# Altium schematic sheet Knock Sensing.SchDoc: Ravage - Knock Sensing
size A4; Address1: Drawn By:; Address2: Dan Visser; DocumentNumber: A; Revision: 0.1-alpha; SheetNumber: 9; SheetTotal: 16
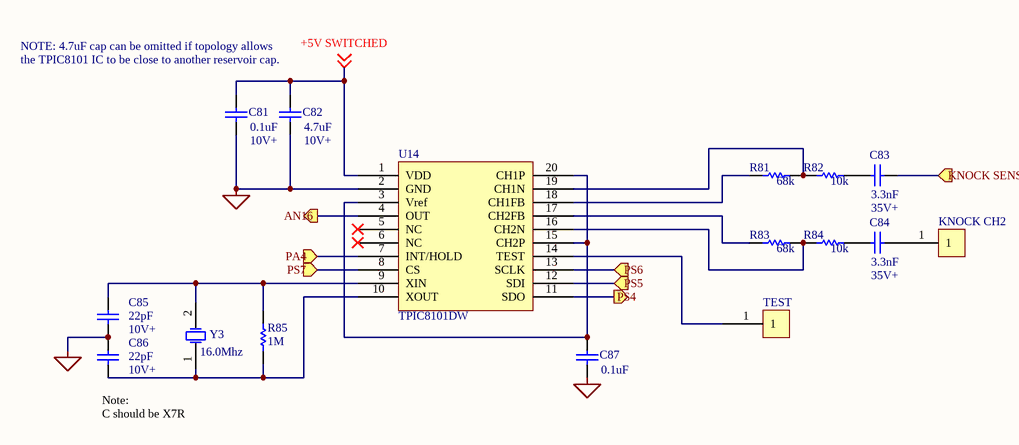
[diagram p0: Knock Sensing.SchDoc]

## Parts
C81  value 0.1uF  [RAD-0.3]
C82  value 4.7uF  [RAD-0.3]
C83  value 3.3nF  [RAD-0.3]
C84  value 3.3nF  [RAD-0.3]
C85  value 22pF  [RAD-0.3]
C86  value 22pF  [RAD-0.3]
C87  value 0.1uF  [RAD-0.3]
KNOCK_CH2  (no value)
R81  value 68k  [AXIAL-0.3]
R82  value 10k  [AXIAL-0.3]
R83  value 68k  [AXIAL-0.3]
R84  value 10k  [AXIAL-0.3]
R85  value 1M  [AXIAL-0.3]
TEST  (no value)
U14  TPIC8101DW  [SOIC20_N]
Y3  16.0Mhz  [R38]

## Ports
AN16 (out), KNOCK SENSOR (in), PA4 (in), PS4 (out), PS5 (in), PS6 (in), PS7 (in)

## Nets
NetC81_1: C81.1 C82.1 C85.1 C86.2 C87.1 U14.2(GND)
+5V SWITCHED: C81.2 C82.2 U14.1(VDD) ; off-sheet +5V SWITCHED
AN16: U14.4(OUT) ; port AN16
KNOCK SENSOR: C83.2 ; port KNOCK SENSOR
PA4: U14.7(INT/HOLD) ; port PA4
PS4: U14.11(SDO) ; port PS4
PS5: U14.12(SDI) ; port PS5
PS6: U14.13(SCLK) ; port PS6
PS7: U14.8(CS) ; port PS7
NetC83_1: C83.1 R82.2
NetC84_1: C84.1 R84.2
NetC84_2: C84.2 KNOCK_CH2.1
NetC85_2: C85.2 R85.1 U14.9(XIN) Y3.2(OSC2)
NetC86_1: C86.1 R85.2 U14.10(XOUT) Y3.1(OSC1)
NetC87_2: C87.2 U14.3(Vref) U14.15(CH2P) U14.20(CH1P)
NetR81_1: R81.1 U14.18(CH1FB)
NetR81_2: R81.2 R82.1 U14.19(CH1N)
NetR83_1: R83.1 U14.17(CH2FB)
NetR83_2: R83.2 R84.1 U14.16(CH2N)
NetTEST_1: TEST.1 U14.14(TEST)

Not connected (* = marked no-connect by the designer): U14 5(NC)* 6(NC)*

## Notes on the sheet
- NOTE: 4.7uF cap can be omitted if topology allows
- the TPIC8101 IC to be close to another reservoir cap.
- 10V+
- (near C82) 10V+
- 35V+
- (near C86) 10V+
- Note:
  C should be X7R
- Title
- Size:
- Date:
- A4
- Number:
- Time:
- Revision:
- Sheet
- of

## Library data of the parts
C81-C87 = Cap: Capacitor; Published: 8-Jun-2000; LatestRevisionDate: 17-Jul-2002; LatestRevisionNote: Re-released for DXP Platform.; PackageReference: RAD-0.3; Publisher: Altium Limited; PackageDescription: Radial Cap, Thru-Hole; 2 Leads; 0.3 in Pin Spacing
KNOCK_CH2 TEST = HEADER 1
R81-R85 = Res1: Resistor; Published: 8-Jun-2000; LatestRevisionDate: 17-Jul-2002; LatestRevisionNote: Re-released for DXP Platform.; PackageReference: AXIAL-0.3; Publisher: Altium Limited; PackageDescription: Axial Device, Thru-Hole; 2 Leads; 0.3 in Pin Spacing
Y3 = XTAL: Crystal Oscillator; Published: 8-Jun-2000; LatestRevisionDate: 17-Jul-2002; LatestRevisionNote: Re-released for DXP Platform.; PackageReference: R38; Publisher: Altium Limited; PackageDescription: Crystal, Thru-Hole; 2 Leads; Body 3.1 x 8.2 mm (Dia.xH)